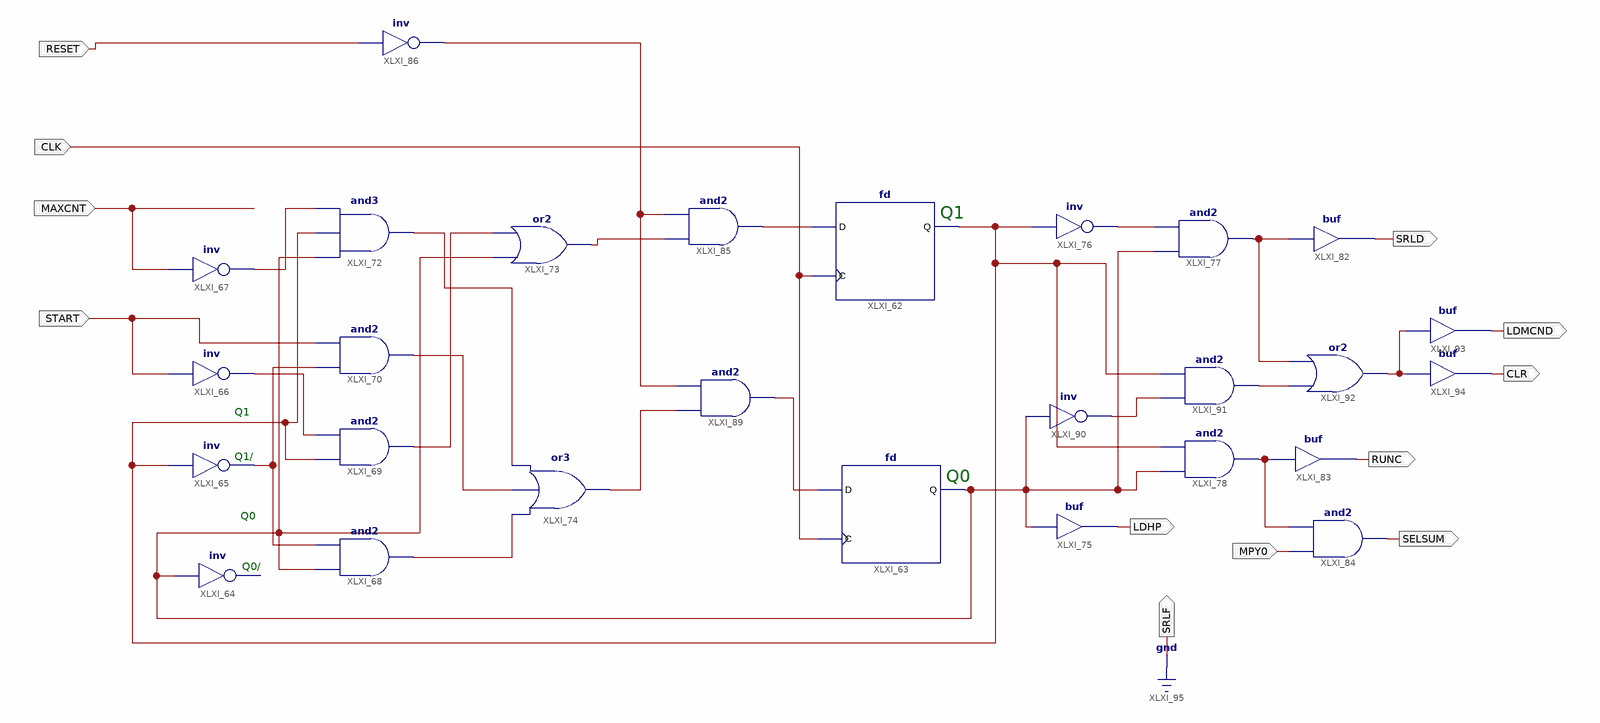
[diagram p0: schematic sheet 1]
// Xilinx ISE schematic controlUnit.sch (spartan3) as structural Verilog: 27 symbols, 12 ports
module controlUnit (
  input  MAXCNT,
  input  START,
  input  CLK,
  input  MPY0,
  input  RESET,
  output LDHP,
  output SRLD,
  output RUNC,
  output SELSUM,
  output LDMCND,
  output CLR,
  output SRLF
);

  wire XLXN_83, XLXN_88, XLXN_89, XLXN_93, XLXN_94, XLXN_95, XLXN_96, XLXN_103, XLXN_109, XLXN_114, XLXN_119,
       XLXN_122, XLXN_129, XLXN_132, XLXN_135, XLXN_136, XLXN_137, XLXN_138, XLXN_139, XLXN_144;

  fd XLXI_63 (.C(CLK), .D(XLXN_136), .Q(XLXN_137));
  // inv XLXI_64 has open pins: I=XLXN_137, O=open
  not XLXI_65 (XLXN_88, XLXN_114);
  not XLXI_66 (XLXN_89, START);
  not XLXI_67 (XLXN_83, MAXCNT);
  and XLXI_68 (XLXN_95, XLXN_137, XLXN_88);
  and XLXI_69 (XLXN_96, XLXN_114, XLXN_89);
  and XLXI_70 (XLXN_94, XLXN_88, START);
  and XLXI_72 (XLXN_93, XLXN_137, XLXN_114, XLXN_83);
  or XLXI_74 (XLXN_135, XLXN_95, XLXN_94, XLXN_93);
  or XLXI_73 (XLXN_129, XLXN_137, XLXN_96);
  fd XLXI_62 (.C(CLK), .D(XLXN_132), .Q(XLXN_114));
  buf XLXI_75 (LDHP, XLXN_137);
  not XLXI_76 (XLXN_103, XLXN_114);
  and XLXI_77 (XLXN_109, XLXN_137, XLXN_103);
  and XLXI_78 (XLXN_119, XLXN_137, XLXN_114);
  buf XLXI_83 (RUNC, XLXN_119);
  and XLXI_84 (SELSUM, MPY0, XLXN_119);
  not XLXI_86 (XLXN_122, RESET);
  and XLXI_89 (XLXN_136, XLXN_135, XLXN_122);
  and XLXI_85 (XLXN_132, XLXN_129, XLXN_122);
  not XLXI_90 (XLXN_138, XLXN_137);
  and XLXI_91 (XLXN_139, XLXN_138, XLXN_114);
  or XLXI_92 (XLXN_144, XLXN_139, XLXN_109);
  buf XLXI_94 (CLR, XLXN_144);
  buf XLXI_93 (LDMCND, XLXN_144);
  buf XLXI_82 (SRLD, XLXN_109);

  assign SRLF = 1'b0;

  // Notes on the sheet:
  //   Q1
  //   Q1
  //   Q1/
  //   Q0
  //   Q0
  //   Q0/
endmodule
